# EAGLE design TheRug-Andabil-R2-prerel (EAGLE 7.7.0)

## Sheet 1 of 2
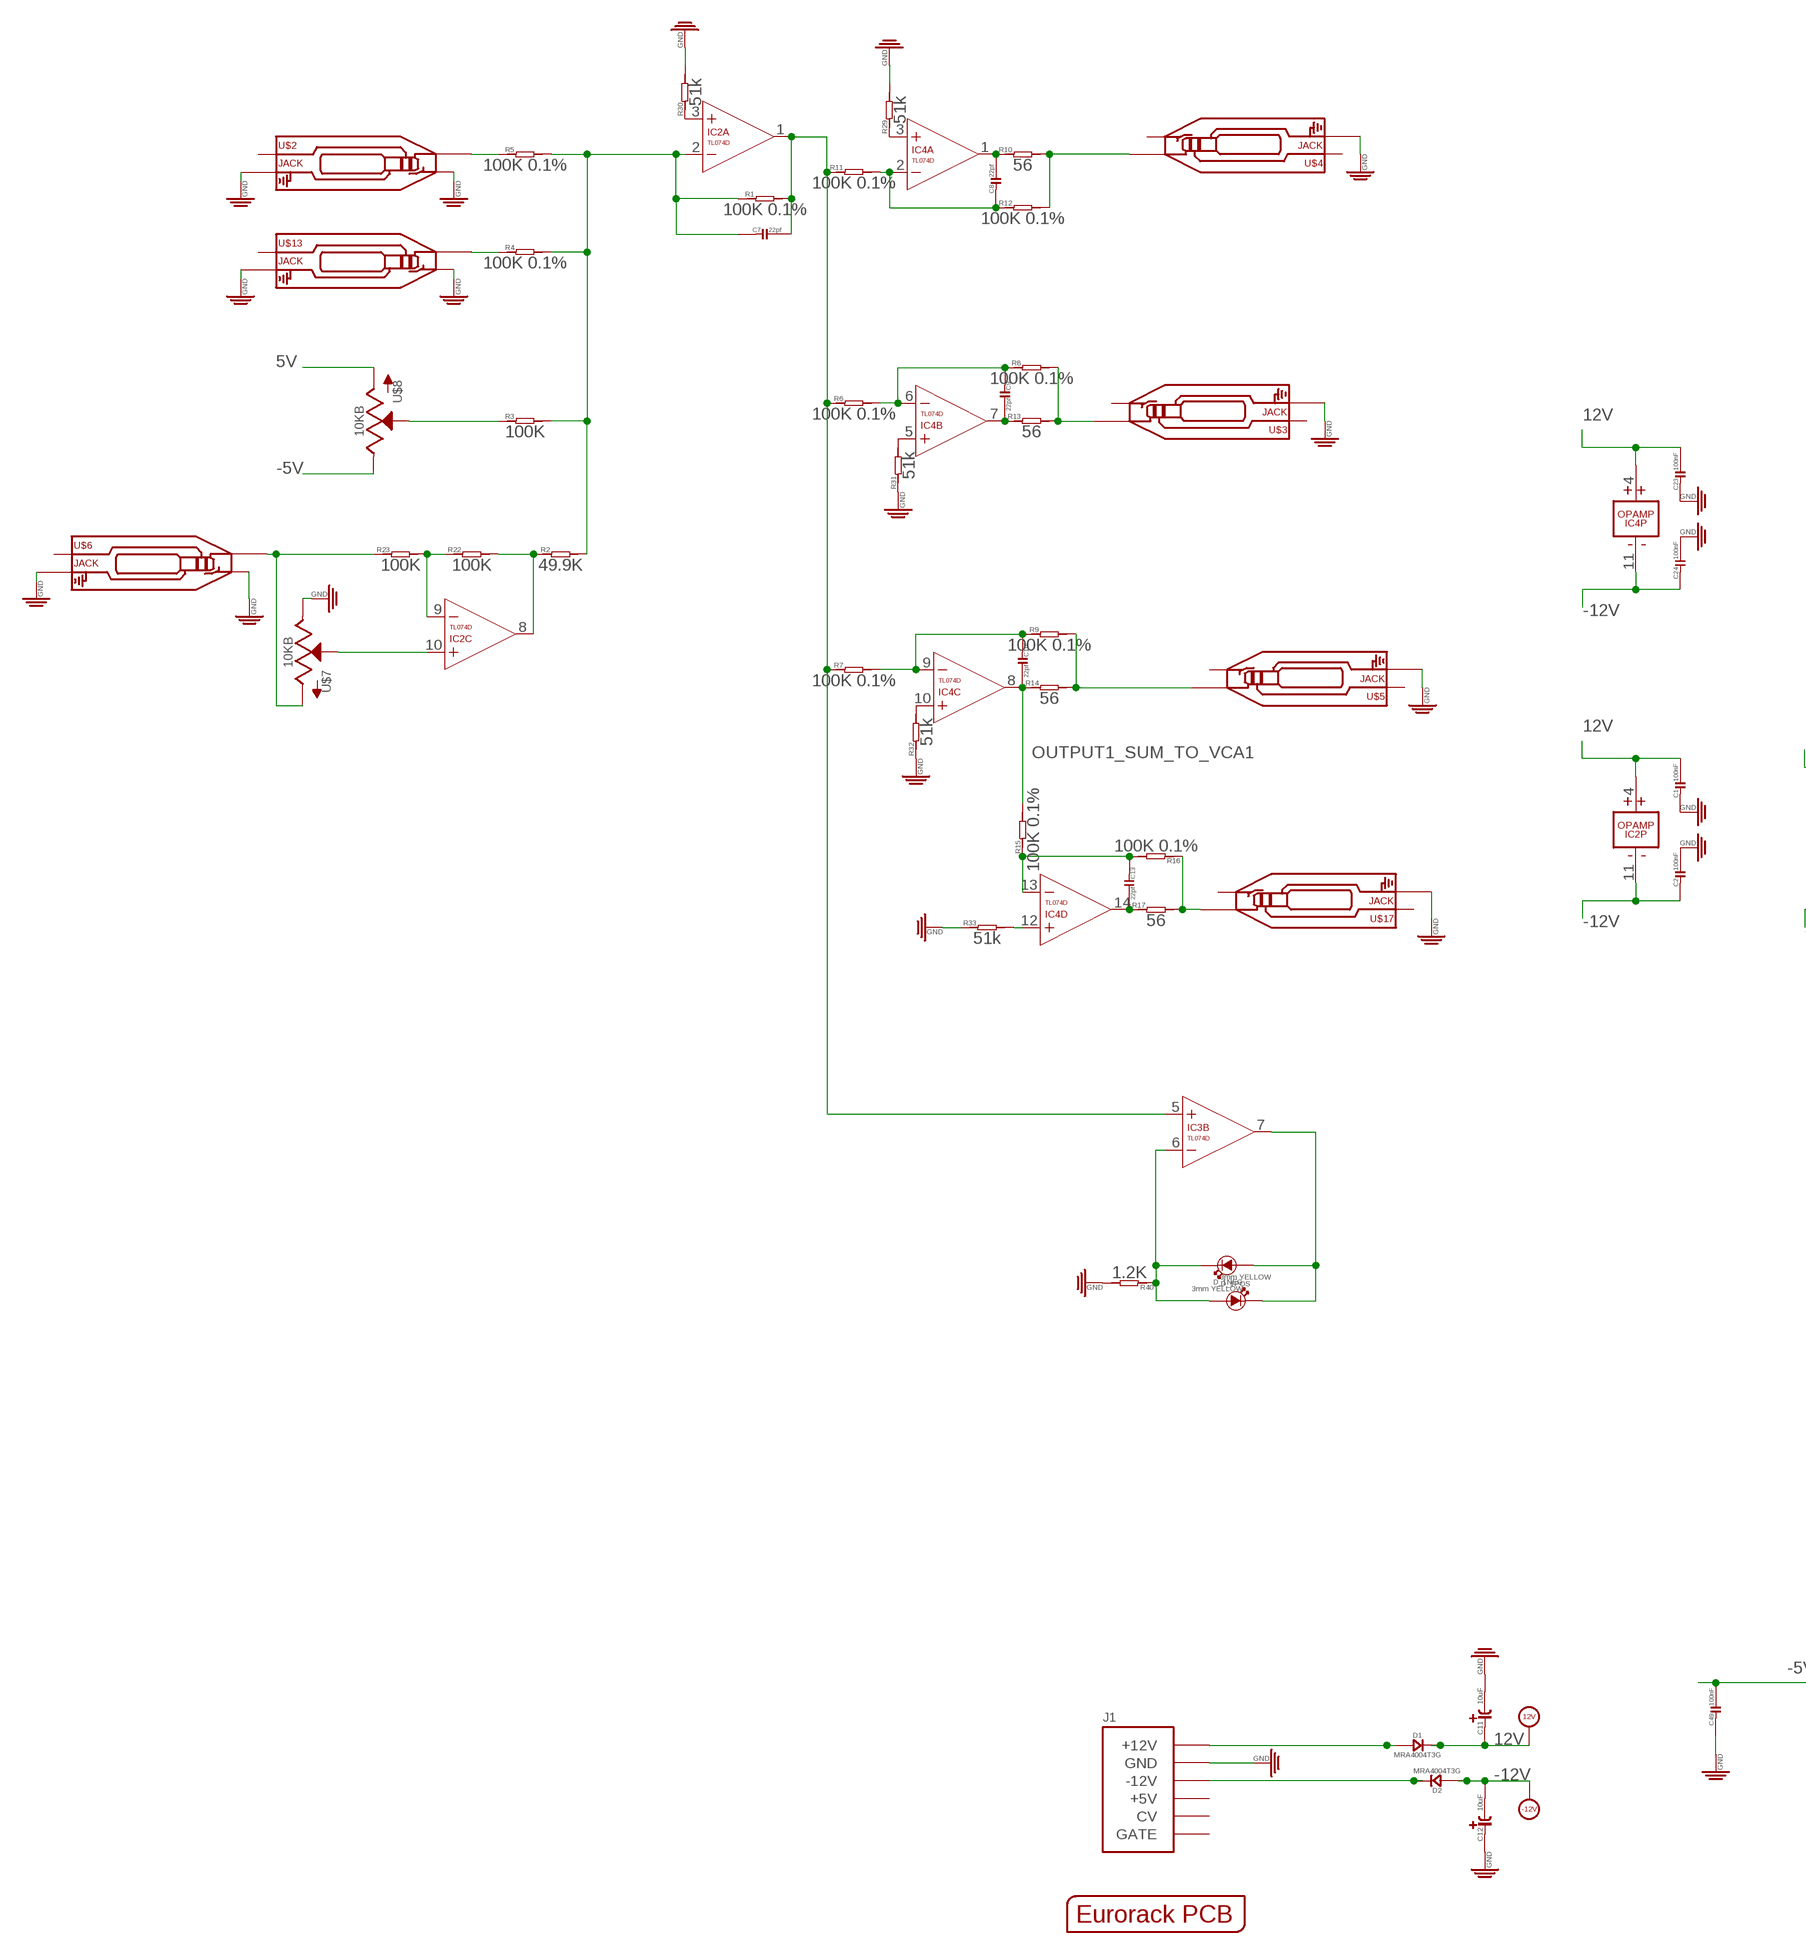
[diagram p0: schematic, sheet 1, part 1 of 2]
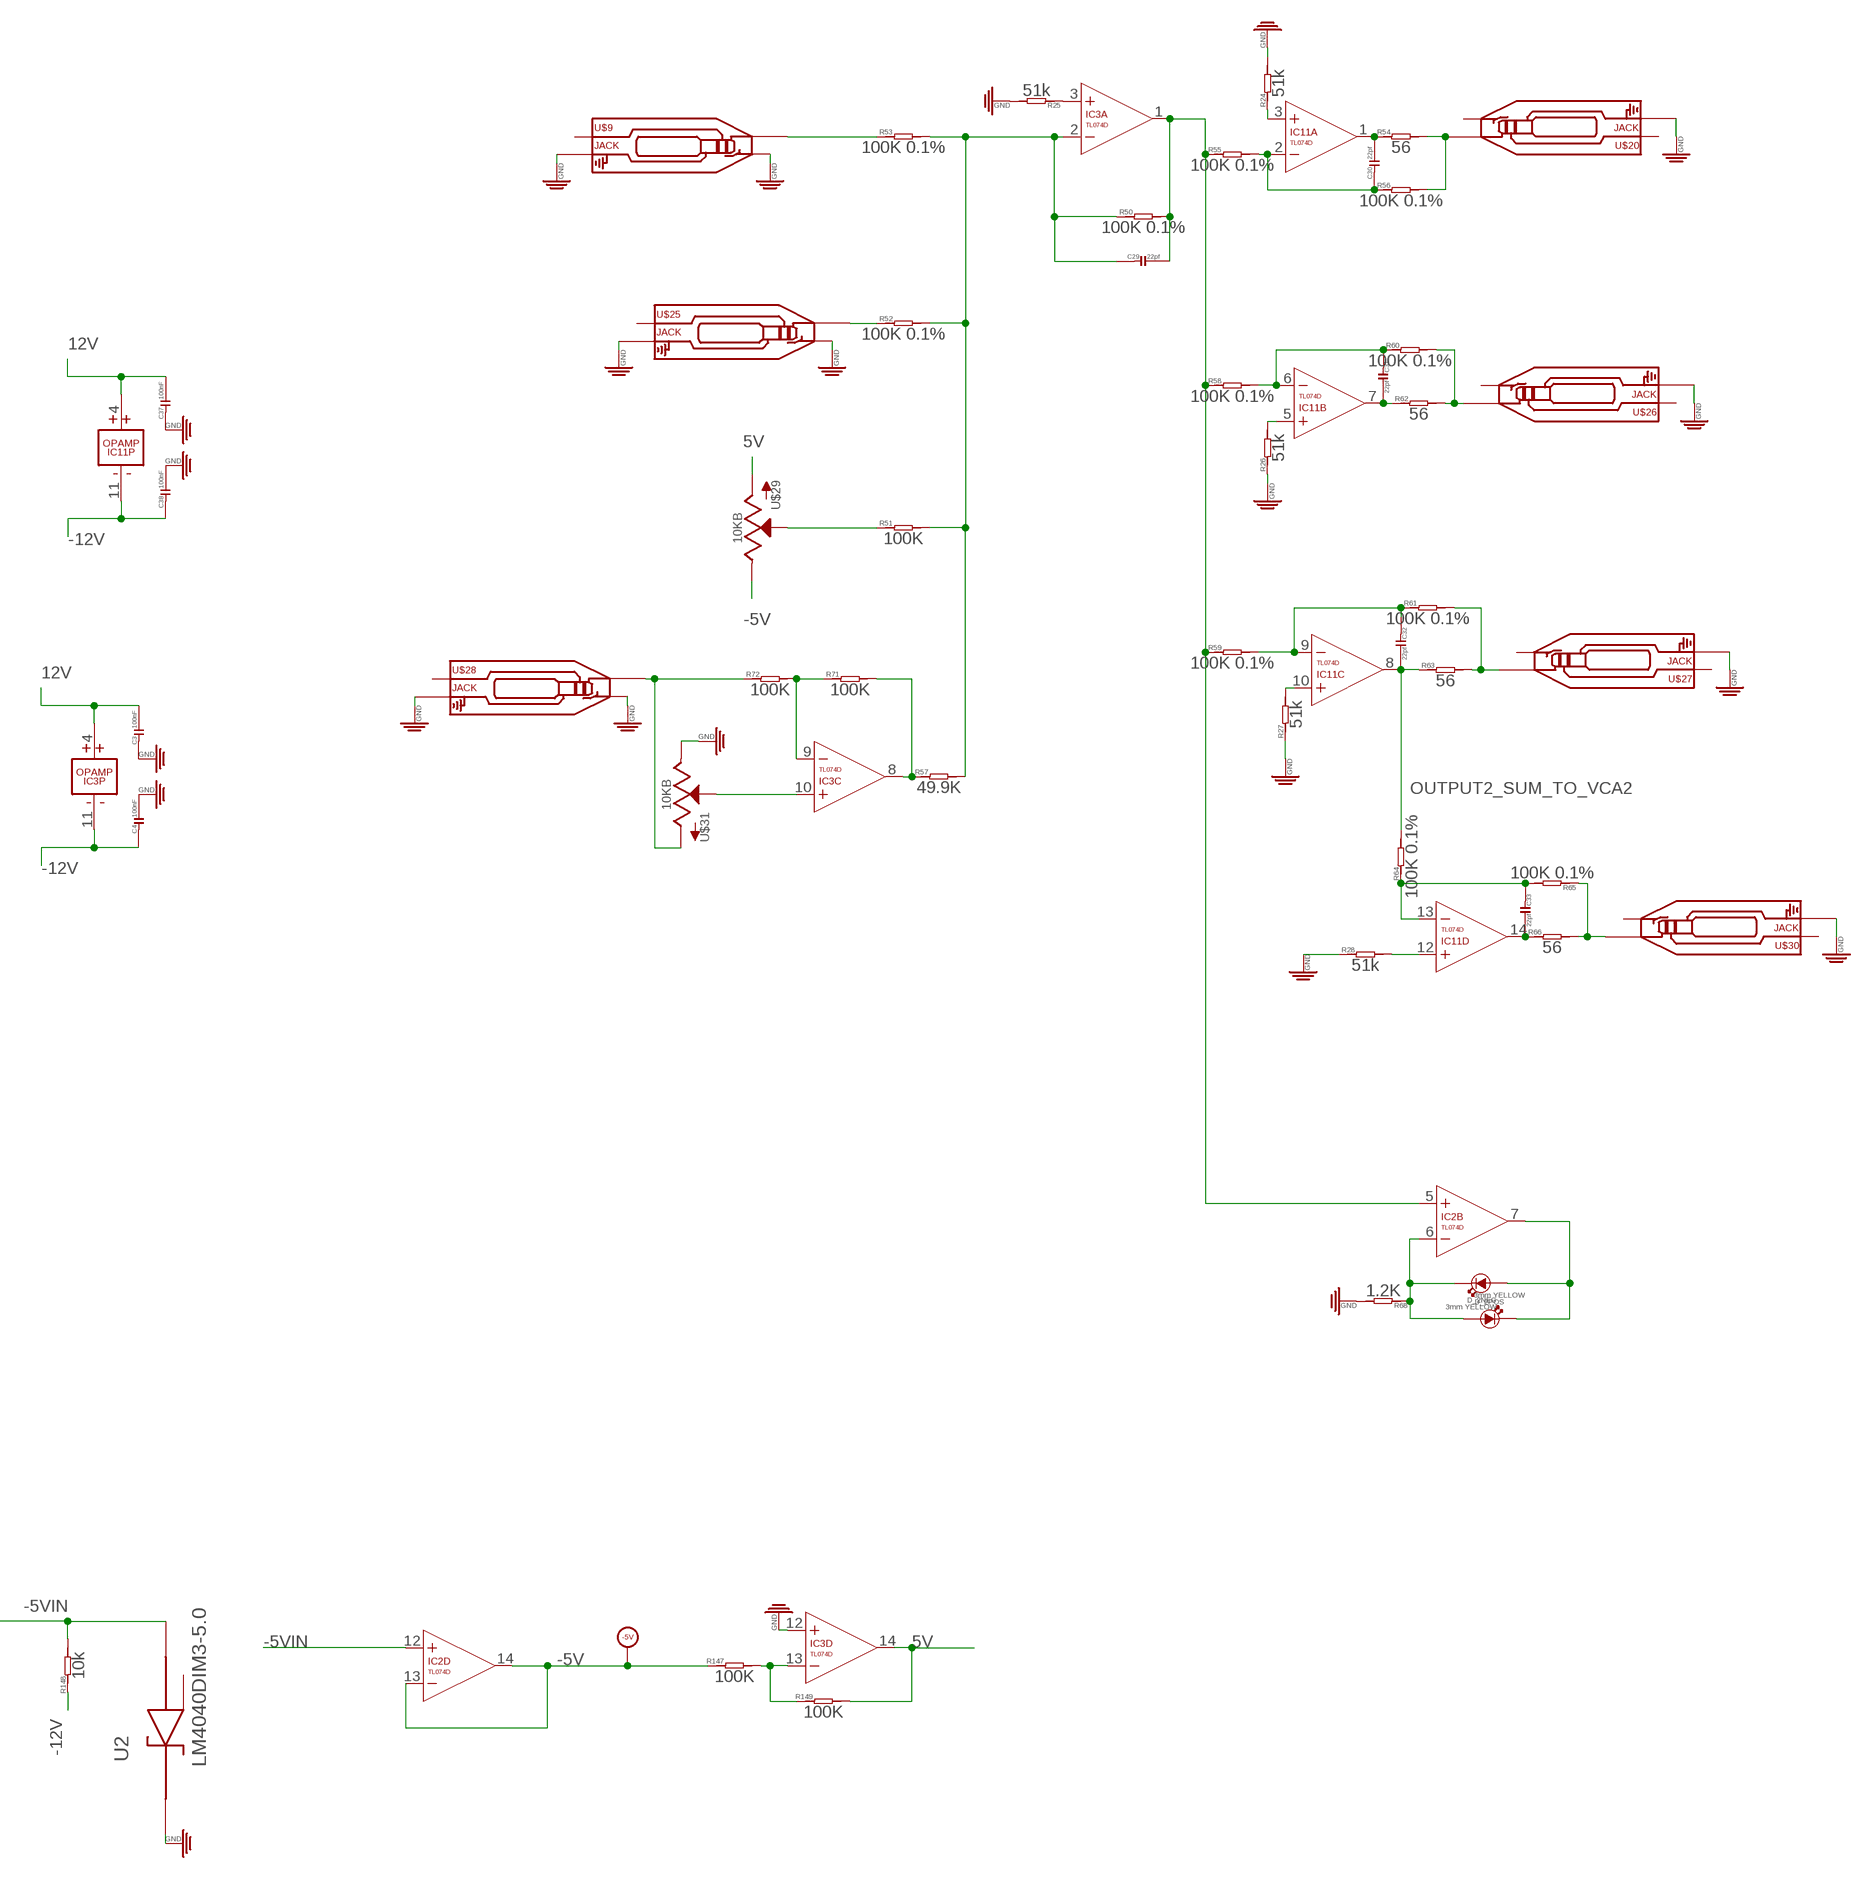
[diagram p1: schematic, sheet 1, part 2 of 2]

### Parts
C1  100nF  C-0603  [C0603]
C2  100nF  C-0603  [C0603]
C3  100nF  C-0603  [C0603]
C4  100nF  C-0603  [C0603]
C7  22pf  C-0603  [C0603]
C8  22pf  C-0603  [C0603]
C9  22pf  C-0603  [C0603]
C10  22pf  C-0603  [C0603]
C11  10uF  C-POLAR-A  [CASE-A_3216]
C12  10uF  C-POLAR-A  [CASE-A_3216]
C13  22pf  C-0603  [C0603]
C23  100nF  C-0603  [C0603]
C24  100nF  C-0603  [C0603]
C29  22pf  C-0603  [C0603]
C30  22pf  C-0603  [C0603]
C31  22pf  C-0603  [C0603]
C32  22pf  C-0603  [C0603]
C33  22pf  C-0603  [C0603]
C37  100nF  C-0603  [C0603]
C38  100nF  C-0603  [C0603]
C49  100nF  C-0603  [C0603]
D1  MRA4004T3G  D-SMA  [DO-214AC]
D2  MRA4004T3G  D-SMA  [DO-214AC]
D_1NEG  3mm YELLOW  LED3MM  [3MMLED]
D_1POS  3mm YELLOW  LED3MM  [3MMLED]
D_2NEG  3mm YELLOW  LED3MM  [3MMLED]
D_2POS  3mm YELLOW  LED3MM  [3MMLED]
IC2  TL074D  [SO14]
IC3  TL074D  [SO14]
IC4  TL074D  [SO14]
IC11  TL074D  [SO14]
J1  POWERSHROUDED  [POWER_16_SHROUDED]
R1  100K 0.1%  R-0603  [R0603]
R2  49.9K  R-0603  [R0603]
R3  100K  R-0603  [R0603]
R4  100K 0.1%  R-0603  [R0603]
R5  100K 0.1%  R-0603  [R0603]
R6  100K 0.1%  R-0603  [R0603]
R7  100K 0.1%  R-0603  [R0603]
R8  100K 0.1%  R-0603  [R0603]
R9  100K 0.1%  R-0603  [R0603]
R10  56  R-0603  [R0603]
R11  100K 0.1%  R-0603  [R0603]
R12  100K 0.1%  R-0603  [R0603]
R13  56  R-0603  [R0603]
R14  56  R-0603  [R0603]
R15  100K 0.1%  R-0603  [R0603]
R16  100K 0.1%  R-0603  [R0603]
R17  56  R-0603  [R0603]
R22  100K  R-0603  [R0603]
R23  100K  R-0603  [R0603]
R24  51k  R-0603  [R0603]
R25  51k  R-0603  [R0603]
R26  51k  R-0603  [R0603]
R27  51k  R-0603  [R0603]
R28  51k  R-0603  [R0603]
R29  51k  R-0603  [R0603]
R30  51k  R-0603  [R0603]
R31  51k  R-0603  [R0603]
R32  51k  R-0603  [R0603]
R33  51k  R-0603  [R0603]
R40  1.2K  R-0603  [R0603]
R50  100K 0.1%  R-0603  [R0603]
R51  100K  R-0603  [R0603]
R52  100K 0.1%  R-0603  [R0603]
R53  100K 0.1%  R-0603  [R0603]
R54  56  R-0603  [R0603]
R55  100K 0.1%  R-0603  [R0603]
R56  100K 0.1%  R-0603  [R0603]
R57  49.9K  R-0603  [R0603]
R58  100K 0.1%  R-0603  [R0603]
R59  100K 0.1%  R-0603  [R0603]
R60  100K 0.1%  R-0603  [R0603]
R61  100K 0.1%  R-0603  [R0603]
R62  56  R-0603  [R0603]
R63  56  R-0603  [R0603]
R64  100K 0.1%  R-0603  [R0603]
R65  100K 0.1%  R-0603  [R0603]
R66  56  R-0603  [R0603]
R68  1.2K  R-0603  [R0603]
R71  100K  R-0603  [R0603]
R72  100K  R-0603  [R0603]
R147  100K  R-0603  [R0603]
R148  10k  R-0603  [R0603]
R149  100K  R-0603  [R0603]
U2  LM4040DIM3-5.0  [SOT95P237X112-3N]
U$1  EURORACK_PCB12HP  [EURORACK12HPPCB]
U$2  JACK  AUDIO-JACK_SMALLSYMBOLNODRILL  [3.5MM-JACK-SWITCH-13MM-NOHOLES]
U$3  JACK  AUDIO-JACK_SMALLSYMBOLNODRILL  [3.5MM-JACK-SWITCH-13MM-NOHOLES]
U$4  JACK  AUDIO-JACK_SMALLSYMBOLNODRILL  [3.5MM-JACK-SWITCH-13MM-NOHOLES]
U$5  JACK  AUDIO-JACK_SMALLSYMBOLNODRILL  [3.5MM-JACK-SWITCH-13MM-NOHOLES]
U$6  JACK  AUDIO-JACK_SMALLSYMBOLNODRILL  [3.5MM-JACK-SWITCH-13MM-NOHOLES]
U$7  10KB  POTSQUAREHOLE_SMALLKNOB  [ALPS_POT_SQUAREHOLES]
U$8  10KB  POTSQUAREHOLE_SMALLKNOB  [ALPS_POT_SQUAREHOLES]
U$9  JACK  AUDIO-JACK_SMALLSYMBOLNODRILL  [3.5MM-JACK-SWITCH-13MM-NOHOLES]
U$13  JACK  AUDIO-JACK_SMALLSYMBOLNODRILL  [3.5MM-JACK-SWITCH-13MM-NOHOLES]
U$17  JACK  AUDIO-JACK_SMALLSYMBOLNODRILL  [3.5MM-JACK-SWITCH-13MM-NOHOLES]
U$20  JACK  AUDIO-JACK_SMALLSYMBOLNODRILL  [3.5MM-JACK-SWITCH-13MM-NOHOLES]
U$25  JACK  AUDIO-JACK_SMALLSYMBOLNODRILL  [3.5MM-JACK-SWITCH-13MM-NOHOLES]
U$26  JACK  AUDIO-JACK_SMALLSYMBOLNODRILL  [3.5MM-JACK-SWITCH-13MM-NOHOLES]
U$27  JACK  AUDIO-JACK_SMALLSYMBOLNODRILL  [3.5MM-JACK-SWITCH-13MM-NOHOLES]
U$28  JACK  AUDIO-JACK_SMALLSYMBOLNODRILL  [3.5MM-JACK-SWITCH-13MM-NOHOLES]
U$29  10KB  POTSQUAREHOLE_SMALLKNOB  [ALPS_POT_SQUAREHOLES]
U$30  JACK  AUDIO-JACK_SMALLSYMBOLNODRILL  [3.5MM-JACK-SWITCH-13MM-NOHOLES]
U$31  10KB  POTSQUAREHOLE_SMALLKNOB  [ALPS_POT_SQUAREHOLES]

### Nets
5V [heavypower]: IC3.14(D:OUT) R149.2 U$8.P$3(A) U$29.P$3(A)
12V [heavypower]: C1.2 C3.2 C11.+ C23.2 C37.2 D1.2(-) IC2.4(P:V+) IC3.4(P:V+) IC4.4(P:V+) IC11.4(P:V+) ; also sheet 2
-5V [heavypower]: IC2.13(D:-IN) IC2.14(D:OUT) R147.1 U$8.P$1(E) U$29.P$1(E) ; also sheet 2
-5V_TO_5V: IC3.13(D:-IN) R147.2 R149.1
-5VIN [heavypower]: C49.2 IC2.12(D:+IN) R148.2 U2.2(ANODE)
-12V [heavypower]: C2.1 C4.1 C12.- C24.1 C38.1 D2.1(+) IC2.11(P:V-) IC3.11(P:V-) IC4.11(P:V-) IC11.11(P:V-) R148.1 ; also sheet 2
GND: C1.1 C2.2 C3.1 C4.2 C11.- C12.+ C23.1 C24.2 C37.1 C38.2 C49.1 IC3.12(D:+IN) J1.3(GND) J1.4(GND) J1.5(GND) J1.6(GND) J1.7(GND) J1.8(GND) R24.2 R25.2 R26.1 R27.1 R28.1 R29.2 R30.2 R31.1 R32.1 R33.1 R40.2 R68.2 U2.1(CATHODE) U$2.RING_B@1(RING) U$2.RING_T@3(RING) U$2.SWITCH_B@1(SWITCH) U$2.SWITCH_T@3(SWITCH) U$3.RING_B@1(RING) U$3.RING_T@3(RING) U$4.RING_B@1(RING) U$4.RING_T@3(RING) U$5.RING_B@1(RING) U$5.RING_T@3(RING) U$6.RING_B@1(RING) U$6.RING_T@3(RING) U$6.SWITCH_B@1(SWITCH) U$6.SWITCH_T@3(SWITCH) U$7.P$1(E) U$9.RING_B@1(RING) U$9.RING_T@3(RING) U$9.SWITCH_B@1(SWITCH) U$9.SWITCH_T@3(SWITCH) U$13.RING_B@1(RING) U$13.RING_T@3(RING) U$13.SWITCH_B@1(SWITCH) U$13.SWITCH_T@3(SWITCH) U$17.RING_B@1(RING) U$17.RING_T@3(RING) U$20.RING_B@1(RING) U$20.RING_T@3(RING) U$25.RING_B@1(RING) U$25.RING_T@3(RING) U$25.SWITCH_B@1(SWITCH) U$25.SWITCH_T@3(SWITCH) U$26.RING_B@1(RING) U$26.RING_T@3(RING) U$27.RING_B@1(RING) U$27.RING_T@3(RING) U$28.RING_B@1(RING) U$28.RING_T@3(RING) U$28.SWITCH_B@1(SWITCH) U$28.SWITCH_T@3(SWITCH) U$30.RING_B@1(RING) U$30.RING_T@3(RING) U$31.P$1(E) ; also sheet 2
N$1: IC2.10(C:+IN) U$7.P$2(S)
N$2: C8.2 IC4.1(A:OUT) R10.1
N$3: IC2.8(C:OUT) R2.1 R22.2
N$4: R23.1 U$6.TIP_B@1(TIP) U$6.TIP_T@3(TIP) U$7.P$3(A)
N$5: C9.1 IC4.6(B:-IN) R6.2 R8.1
N$6: R3.1 U$8.P$2(S)
N$7: C7.2 IC2.1(A:OUT) IC3.5(B:+IN) R1.2 R6.1 R7.1 R11.1
N$8: C8.1 IC4.2(A:-IN) R11.2 R12.1
N$9: C10.1 IC4.9(C:-IN) R7.2 R9.1
N$10: IC2.9(C:-IN) R22.1 R23.2
N$11: C9.2 IC4.7(B:OUT) R13.1
N$12: R4.1 U$13.TIP_B@1(TIP) U$13.TIP_T@3(TIP)
N$13: R60.2 R62.2 U$26.TIP_B@1(TIP) U$26.TIP_T@3(TIP)
N$14: C7.1 IC2.2(A:-IN) R1.1 R2.2 R3.2 R4.2 R5.2
N$15: R8.2 R13.2 U$3.TIP_B@1(TIP) U$3.TIP_T@3(TIP)
N$16: R9.2 R14.2 U$5.TIP_B@1(TIP) U$5.TIP_T@3(TIP)
N$17: C13.1 IC4.13(D:-IN) R15.1 R16.2
N$18: C13.2 IC4.14(D:OUT) R17.1
N$19: R16.1 R17.2 U$17.TIP_B@1(TIP) U$17.TIP_T@3(TIP)
N$20: R5.1 U$2.TIP_B@1(TIP) U$2.TIP_T@3(TIP)
N$22: R10.2 R12.2 U$4.TIP_B@1(TIP) U$4.TIP_T@3(TIP)
N$26: IC11.3(A:+IN) R24.1
N$27: IC3.3(A:+IN) R25.1
N$28 [heavypower]: D1.1(+) J1.9(+12V) J1.10(+12V)
N$29: IC11.5(B:+IN) R26.2
N$30: IC11.10(C:+IN) R27.2
N$31: R65.1 R66.2 U$30.TIP_B@1(TIP) U$30.TIP_T@3(TIP)
N$32: IC11.12(D:+IN) R28.2
N$33: IC4.3(A:+IN) R29.1
N$34: IC2.3(A:+IN) R30.1
N$35: IC4.5(B:+IN) R31.2
N$36: IC4.10(C:+IN) R32.2
N$37: IC4.12(D:+IN) R33.2
N$44: D_1NEG.- D_1POS.+ IC3.6(B:-IN) R40.1
N$45: D_1NEG.+ D_1POS.- IC3.7(B:OUT)
N$53: C30.2 IC11.1(A:OUT) R54.1
N$54: R51.1 U$29.P$2(S)
N$63: R52.1 U$25.TIP_B@1(TIP) U$25.TIP_T@3(TIP)
N$64 [heavypower]: D2.2(-) J1.1(-12V) J1.2(-12V)
N$65: C29.1 IC3.2(A:-IN) R50.1 R51.2 R52.2 R53.2 R57.2
N$66: R54.2 R56.2 U$20.TIP_B@1(TIP) U$20.TIP_T@3(TIP)
N$67: C29.2 IC2.5(B:+IN) IC3.1(A:OUT) R50.2 R55.1 R58.1 R59.1
N$68: C30.1 IC11.2(A:-IN) R55.2 R56.1
N$69: R53.1 U$9.TIP_B@1(TIP) U$9.TIP_T@3(TIP)
N$70: R72.1 U$28.TIP_B@1(TIP) U$28.TIP_T@3(TIP) U$31.P$3(A)
N$71: C31.1 IC11.6(B:-IN) R58.2 R60.1
N$72: C32.1 IC11.9(C:-IN) R59.2 R61.1
N$73: C31.2 IC11.7(B:OUT) R62.1
N$76: R61.2 R63.2 U$27.TIP_B@1(TIP) U$27.TIP_T@3(TIP)
N$77: C33.1 IC11.13(D:-IN) R64.1 R65.2
N$78: C33.2 IC11.14(D:OUT) R66.1
N$80: D_2NEG.- D_2POS.+ IC2.6(B:-IN) R68.1
N$81: D_2NEG.+ D_2POS.- IC2.7(B:OUT)
N$84: IC3.10(C:+IN) U$31.P$2(S)
N$85: IC3.8(C:OUT) R57.1 R71.2
N$86: IC3.9(C:-IN) R71.1 R72.2
OUTPUT1_SUM_TO_VCA1: C10.2 IC4.8(C:OUT) R14.1 R15.2 ; also sheet 2
OUTPUT2_SUM_TO_VCA2: C32.2 IC11.8(C:OUT) R63.1 R64.2 ; also sheet 2
Unconnected: J1.11(+5V) J1.12(+5V) J1.13(CV) J1.14(CV) J1.15(GATE) J1.16(GATE) U2.3(NC) U$2.SECOND_B@1(SECOND) U$2.SECOND_T@3(SECOND) U$3.SECOND_B@1(SECOND) U$3.SECOND_T@3(SECOND) U$3.SWITCH_B@1(SWITCH) U$3.SWITCH_T@3(SWITCH) U$4.SECOND_B@1(SECOND) U$4.SECOND_T@3(SECOND) U$4.SWITCH_B@1(SWITCH) U$4.SWITCH_T@3(SWITCH) U$5.SECOND_B@1(SECOND) U$5.SECOND_T@3(SECOND) U$5.SWITCH_B@1(SWITCH) U$5.SWITCH_T@3(SWITCH) U$6.SECOND_B@1(SECOND) U$6.SECOND_T@3(SECOND) U$9.SECOND_B@1(SECOND) U$9.SECOND_T@3(SECOND) U$13.SECOND_B@1(SECOND) U$13.SECOND_T@3(SECOND) U$17.SECOND_B@1(SECOND) U$17.SECOND_T@3(SECOND) U$17.SWITCH_B@1(SWITCH) U$17.SWITCH_T@3(SWITCH) U$20.SECOND_B@1(SECOND) U$20.SECOND_T@3(SECOND) U$20.SWITCH_B@1(SWITCH) U$20.SWITCH_T@3(SWITCH) U$25.SECOND_B@1(SECOND) U$25.SECOND_T@3(SECOND) U$26.SECOND_B@1(SECOND) U$26.SECOND_T@3(SECOND) U$26.SWITCH_B@1(SWITCH) U$26.SWITCH_T@3(SWITCH) U$27.SECOND_B@1(SECOND) U$27.SECOND_T@3(SECOND) U$27.SWITCH_B@1(SWITCH) U$27.SWITCH_T@3(SWITCH) U$28.SECOND_B@1(SECOND) U$28.SECOND_T@3(SECOND) U$30.SECOND_B@1(SECOND) U$30.SECOND_T@3(SECOND) U$30.SWITCH_B@1(SWITCH) U$30.SWITCH_T@3(SWITCH)

## Sheet 2 of 2
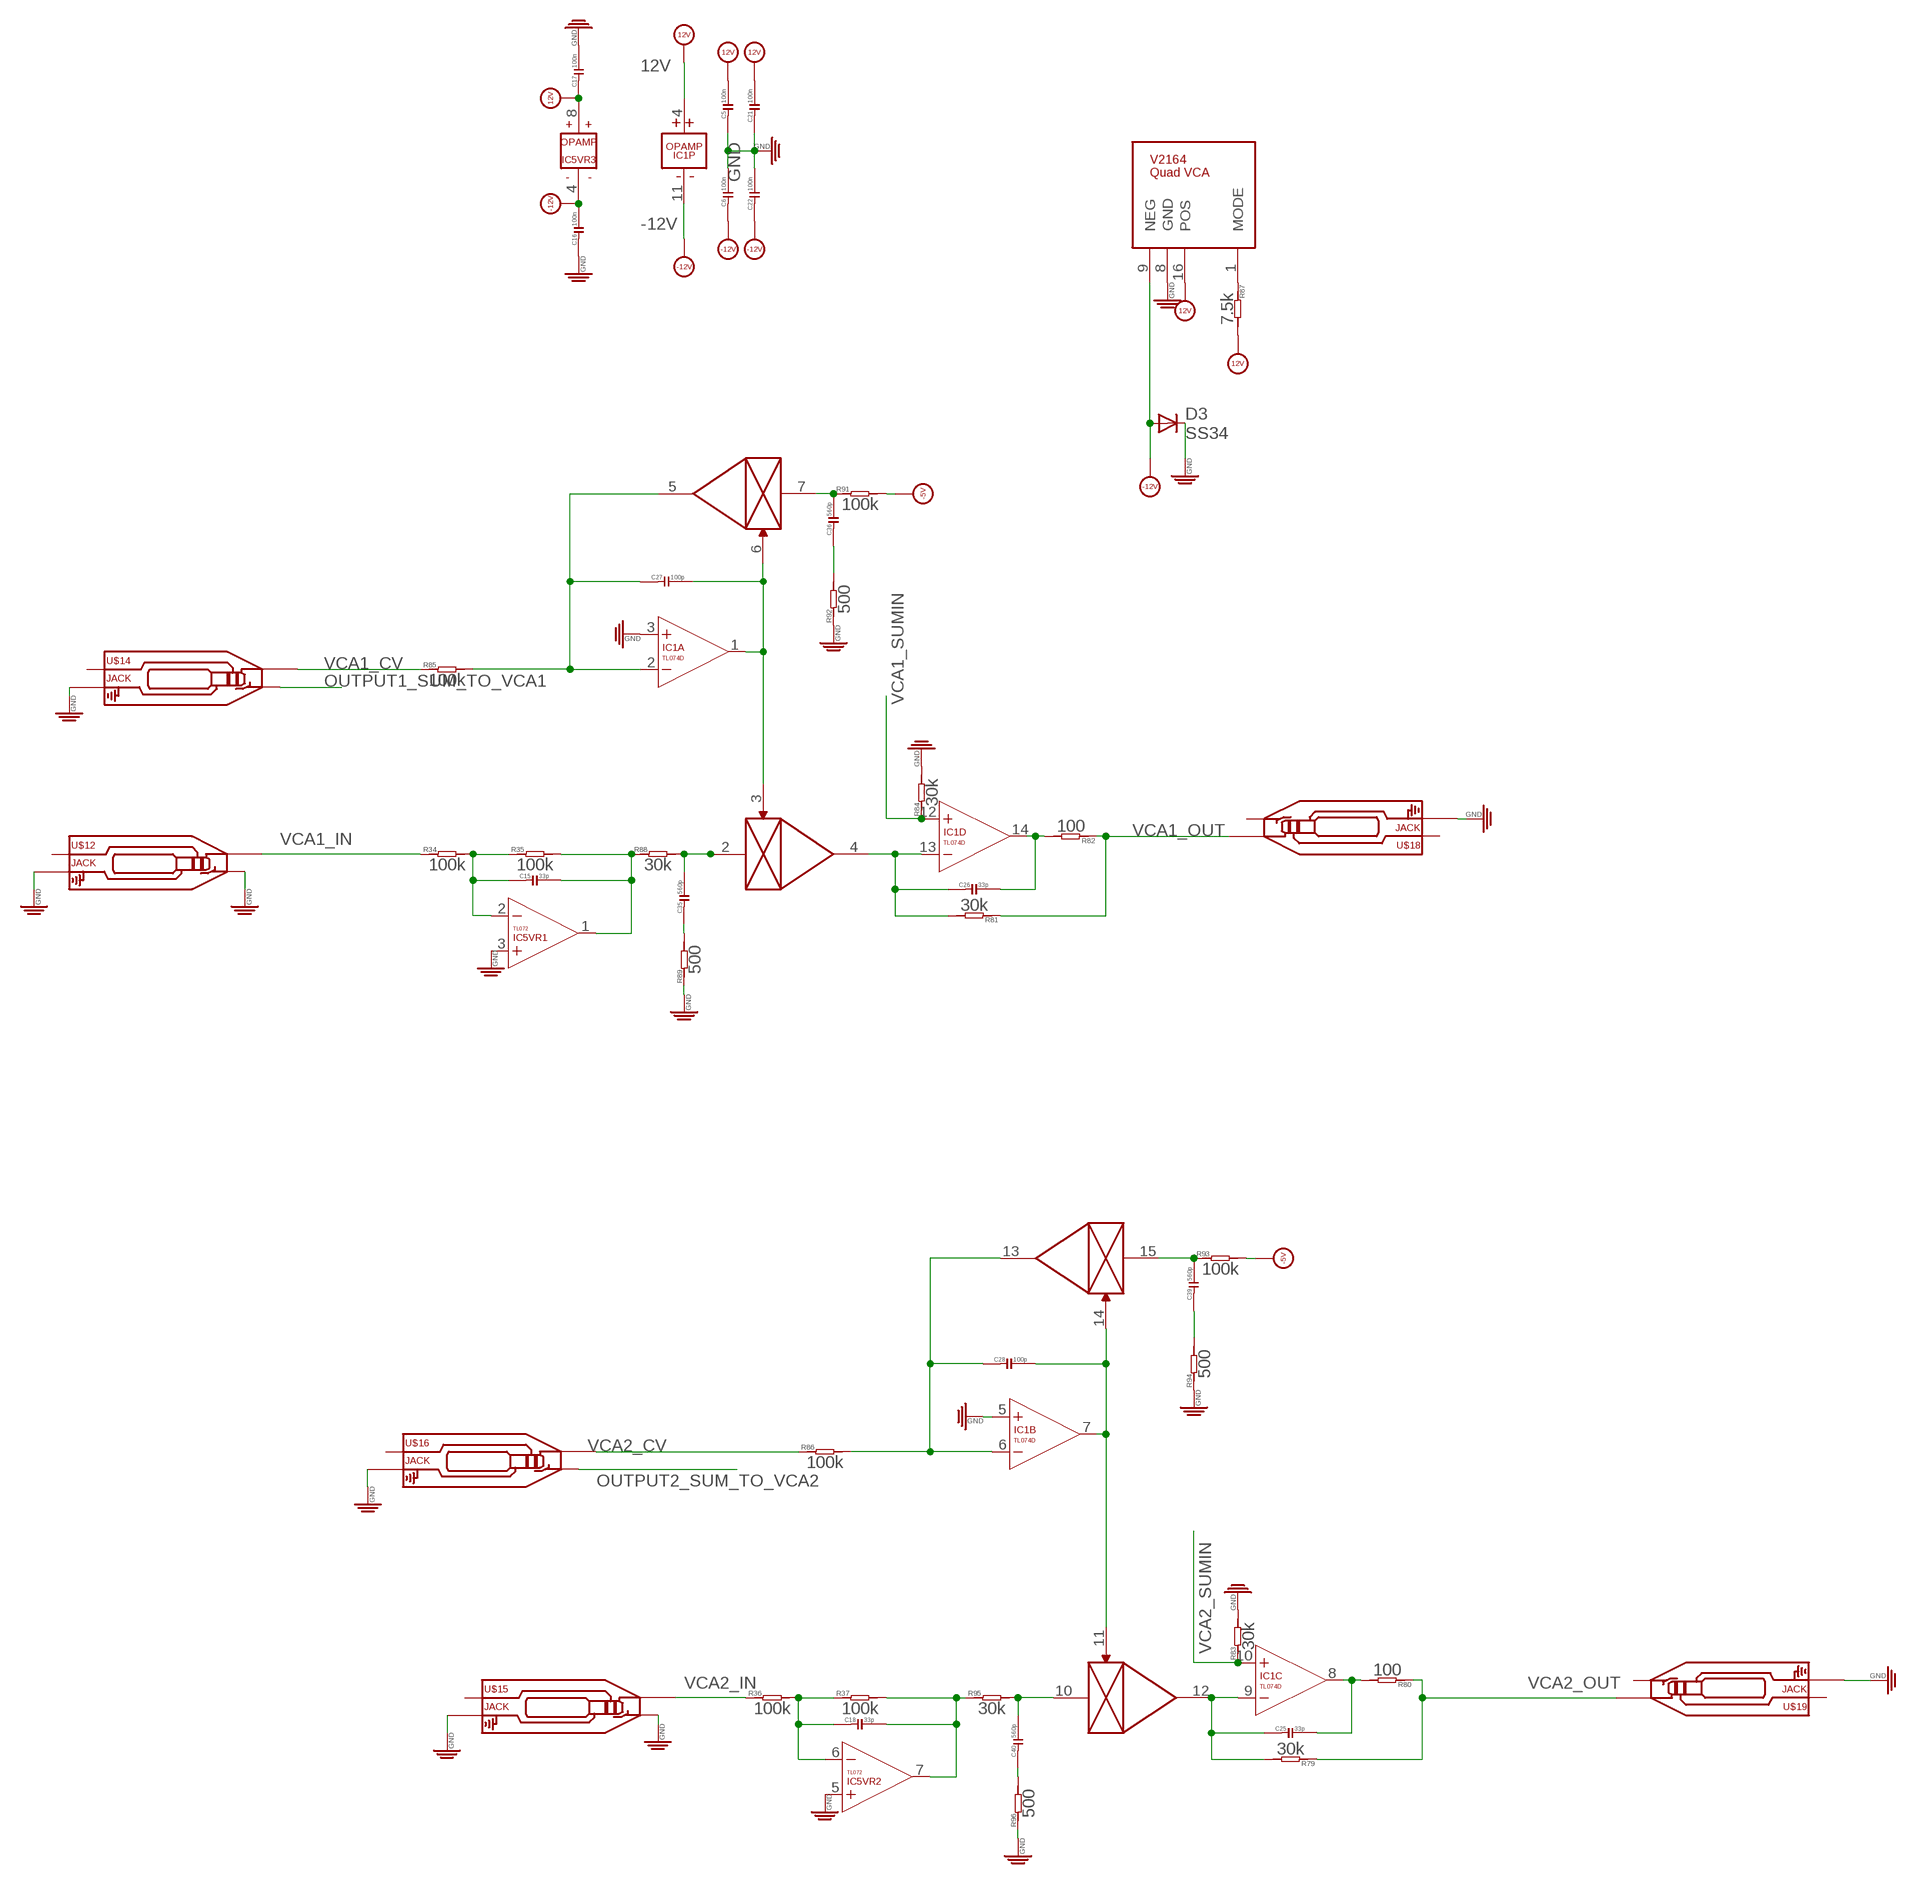
[diagram p2: schematic, sheet 2]

### Parts
C5  100n  C-0603  [C0603]
C6  100n  C-0603  [C0603]
C15  33p  C-0603  [C0603]
C16  100n  C-0603  [C0603]
C17  100n  C-0603  [C0603]
C18  33p  C-0603  [C0603]
C21  100n  C-0603  [C0603]
C22  100n  C-0603  [C0603]
C25  33p  C-0603  [C0603]
C26  33p  C-0603  [C0603]
C27  100p  C-0603  [C0603]
C28  100p  C-0603  [C0603]
C35  560p  C-0603  [C0603]
C36  560p  C-0603  [C0603]
C39  560p  C-0603  [C0603]
C40  560p  C-0603  [C0603]
D3  SS34  DIODE-DO-214AC  [DO-214AC]
IC1  TL074D  [SO14]
IC5  TL072  [SO08]
R34  100k  R-0603  [R0603]
R35  100k  R-0603  [R0603]
R36  100k  R-0603  [R0603]
R37  100k  R-0603  [R0603]
R79  30k  R-0603  [R0603]
R80  100  R-0603  [R0603]
R81  30k  R-0603  [R0603]
R82  100  R-0603  [R0603]
R83  30k  R-0603  [R0603]
R84  30k  R-0603  [R0603]
R85  100k  R-0603  [R0603]
R86  100k  R-0603  [R0603]
R87  7.5k  R-0603  [R0603]
R88  30k  R-0603  [R0603]
R89  500  R-0603  [R0603]
R91  100k  R-0603  [R0603]
R92  500  R-0603  [R0603]
R93  100k  R-0603  [R0603]
R94  500  R-0603  [R0603]
R95  30k  R-0603  [R0603]
R96  500  R-0603  [R0603]
U$12  JACK  AUDIO-JACK_SMALLSYMBOLNODRILL  [3.5MM-JACK-SWITCH-13MM-NOHOLES]
U$14  JACK  AUDIO-JACK_SMALLSYMBOLNODRILL  [3.5MM-JACK-SWITCH-13MM-NOHOLES]
U$15  JACK  AUDIO-JACK_SMALLSYMBOLNODRILL  [3.5MM-JACK-SWITCH-13MM-NOHOLES]
U$16  JACK  AUDIO-JACK_SMALLSYMBOLNODRILL  [3.5MM-JACK-SWITCH-13MM-NOHOLES]
U$18  JACK  AUDIO-JACK_SMALLSYMBOLNODRILL  [3.5MM-JACK-SWITCH-13MM-NOHOLES]
U$19  JACK  AUDIO-JACK_SMALLSYMBOLNODRILL  [3.5MM-JACK-SWITCH-13MM-NOHOLES]
U$32  V2164  [SO16]

### Nets
12V [heavypower]: C5.2 C17.1 C21.2 IC1.4(P:V+) IC5.8(VR3:V+) R87.2 U$32.16(PWR:POS) ; also sheet 1
-5V [heavypower]: R91.2 R93.2 ; also sheet 1
-12V [heavypower]: C6.1 C16.2 C22.1 D3.2(A) IC1.11(P:V-) IC5.4(VR3:V-) U$32.9(PWR:NEG) ; also sheet 1
GND: C5.1 C6.2 C16.1 C17.2 C21.1 C22.2 D3.1(C) IC1.3(A:+IN) IC1.5(B:+IN) IC5.3(VR1:+IN) IC5.5(VR2:+IN) R83.2 R84.2 R89.1 R92.1 R94.1 R96.1 U$12.RING_B@1(RING) U$12.RING_T@3(RING) U$12.SWITCH_B@1(SWITCH) U$12.SWITCH_T@3(SWITCH) U$14.RING_B@1(RING) U$14.RING_T@3(RING) U$15.RING_B@1(RING) U$15.RING_T@3(RING) U$15.SWITCH_B@1(SWITCH) U$15.SWITCH_T@3(SWITCH) U$16.RING_B@1(RING) U$16.RING_T@3(RING) U$18.RING_B@1(RING) U$18.RING_T@3(RING) U$19.RING_B@1(RING) U$19.RING_T@3(RING) U$32.8(PWR:GND) ; also sheet 1
N$38: C15.1 IC5.2(VR1:-IN) R34.2 R35.1
N$39: C15.2 IC5.1(VR1:OUT) R35.2 R88.1
N$40: C18.1 IC5.6(VR2:-IN) R36.2 R37.1
N$41: C18.2 IC5.7(VR2:OUT) R37.2 R95.1
N$61: C25.2 IC1.8(C:OUT) R80.2
N$74: C25.1 IC1.9(C:-IN) R79.2 U$32.12(C:OUT)
N$87: C26.2 IC1.14(D:OUT) R82.2
N$88: C26.1 IC1.13(D:-IN) R81.2 U$32.4(A:OUT)
N$89: C27.2 IC1.1(A:OUT) U$32.3(A:CV) U$32.6(B:CV)
N$90: C28.1 IC1.6(B:-IN) R86.2 U$32.13(D:OUT)
N$91: C28.2 IC1.7(B:OUT) U$32.11(C:CV) U$32.14(D:CV)
N$92: R87.1 U$32.1(PWR:MODE)
N$93: C35.1 R89.2
N$94: C35.2 R88.2 U$32.2(A:IN)
N$95: C36.2 R91.1 U$32.7(B:IN)
N$96: C36.1 R92.2
N$97: C39.2 R93.1 U$32.15(D:IN)
N$98: C39.1 R94.2
N$99: C40.1 R96.2
N$100: C40.2 R95.2 U$32.10(C:IN)
OUTPUT1_SUM_TO_VCA1: U$14.SWITCH_B@1(SWITCH) U$14.SWITCH_T@3(SWITCH) ; also sheet 1
OUTPUT2_SUM_TO_VCA2: U$16.SWITCH_B@1(SWITCH) U$16.SWITCH_T@3(SWITCH) ; also sheet 1
VCA1_CV: R85.1 U$14.TIP_B@1(TIP) U$14.TIP_T@3(TIP)
VCA1_FB: C27.1 IC1.2(A:-IN) R85.2 U$32.5(B:OUT)
VCA1_IN: R34.1 U$12.TIP_B@1(TIP) U$12.TIP_T@3(TIP)
VCA1_OUT: R81.1 R82.1 U$18.TIP_B@1(TIP) U$18.TIP_T@3(TIP)
VCA1_SUMIN: IC1.12(D:+IN) R84.1
VCA2_CV: R86.1 U$16.TIP_B@1(TIP) U$16.TIP_T@3(TIP)
VCA2_IN: R36.1 U$15.TIP_B@1(TIP) U$15.TIP_T@3(TIP)
VCA2_OUT: R79.1 R80.1 U$19.TIP_B@1(TIP) U$19.TIP_T@3(TIP)
VCA2_SUMIN: IC1.10(C:+IN) R83.1
Unconnected: U$12.SECOND_B@1(SECOND) U$12.SECOND_T@3(SECOND) U$14.SECOND_B@1(SECOND) U$14.SECOND_T@3(SECOND) U$15.SECOND_B@1(SECOND) U$15.SECOND_T@3(SECOND) U$16.SECOND_B@1(SECOND) U$16.SECOND_T@3(SECOND) U$18.SECOND_B@1(SECOND) U$18.SECOND_T@3(SECOND) U$18.SWITCH_B@1(SWITCH) U$18.SWITCH_T@3(SWITCH) U$19.SECOND_B@1(SECOND) U$19.SECOND_T@3(SECOND) U$19.SWITCH_B@1(SWITCH) U$19.SWITCH_T@3(SWITCH)

## Library data of the parts
C1-C10 C13 C15-C18 C21-C33 C35-C40 = OPL:C*
C11 C12 = EurorackModularParts:C-POLAR*
C49 = OPL:C*; MF: AVX; MPN: 06035C104KAT2A; OC_FARNELL: 1301804
D1 D2 = OPL:D*: DIODE; MF: VISHAY; MPN: US1G-E3/5AT; OC_FARNELL: 9551824
D3 = dp_devices:DIODE: Various Diode Packages
D_1NEG D_1POS D_2NEG D_2POS = EurorackModularParts:LED*: LED
IC1-IC4 IC11 = EurorackModularParts:TL074: OP AMP
IC5 = EurorackModularParts:TL072
J1 = EurorackModularParts:POWER
R1-R17 R22-R37 R40 R50-R66 R68 R71 R72 R79-R89 R91-R96 R147 R149 = OPL:R*
R148 = OPL:R*; OC_FARNELL: unknown
U2 = FarnellThings:LM4040DIM3-5.0: IC, Precision Micropower Shunt Voltage Reference, 5V,SOT-23-3; MF: TEXAS INSTRUMENTS; MPN: LM4040DIM3-5.0; OC_FARNELL: 9778330; OC_NEWARK: 97K3489; PACKAGE: SOT-23-3; SUPPLIER: TEXAS INSTRUMENTS
U$1 = EurorackModularParts:EURORACK_PCB
U$2 = EurorackModularParts:AUDIO-JACK_SMALLSYMBOL: Switching Mono 3.5mm Audio Jack from Erthenvar.; DESC: 1: A
U$3 = EurorackModularParts:AUDIO-JACK_SMALLSYMBOL: Switching Mono 3.5mm Audio Jack from Erthenvar.; DESC: 1: Out 2
U$4 = EurorackModularParts:AUDIO-JACK_SMALLSYMBOL: Switching Mono 3.5mm Audio Jack from Erthenvar.; DESC: 1: Out 1
U$5 = EurorackModularParts:AUDIO-JACK_SMALLSYMBOL: Switching Mono 3.5mm Audio Jack from Erthenvar.; DESC: 1: Out 3
U$6 = EurorackModularParts:AUDIO-JACK_SMALLSYMBOL: Switching Mono 3.5mm Audio Jack from Erthenvar.; DESC: 1: C
U$7 = EurorackModularParts:POT; DESC: 1: C Amp
U$8 = EurorackModularParts:POT; DESC: 1: Offset
U$9 = EurorackModularParts:AUDIO-JACK_SMALLSYMBOL: Switching Mono 3.5mm Audio Jack from Erthenvar.; DESC: 2: A
U$12 = EurorackModularParts:AUDIO-JACK_SMALLSYMBOL: Switching Mono 3.5mm Audio Jack from Erthenvar.; DESC: VCA1 In
U$13 = EurorackModularParts:AUDIO-JACK_SMALLSYMBOL: Switching Mono 3.5mm Audio Jack from Erthenvar.; DESC: 1: B
U$14 = EurorackModularParts:AUDIO-JACK_SMALLSYMBOL: Switching Mono 3.5mm Audio Jack from Erthenvar.; DESC: VCA1 CV
U$15 = EurorackModularParts:AUDIO-JACK_SMALLSYMBOL: Switching Mono 3.5mm Audio Jack from Erthenvar.; DESC: VCA2 In
U$16 = EurorackModularParts:AUDIO-JACK_SMALLSYMBOL: Switching Mono 3.5mm Audio Jack from Erthenvar.; DESC: VCA2 CV
U$17 = EurorackModularParts:AUDIO-JACK_SMALLSYMBOL: Switching Mono 3.5mm Audio Jack from Erthenvar.; DESC: 1: Inverted
U$18 = EurorackModularParts:AUDIO-JACK_SMALLSYMBOL: Switching Mono 3.5mm Audio Jack from Erthenvar.; DESC: VCA1 Out
U$19 = EurorackModularParts:AUDIO-JACK_SMALLSYMBOL: Switching Mono 3.5mm Audio Jack from Erthenvar.; DESC: VCA2 Out
U$20 = EurorackModularParts:AUDIO-JACK_SMALLSYMBOL: Switching Mono 3.5mm Audio Jack from Erthenvar.; DESC: 2: Out 1
U$25 = EurorackModularParts:AUDIO-JACK_SMALLSYMBOL: Switching Mono 3.5mm Audio Jack from Erthenvar.; DESC: 2: B
U$26 = EurorackModularParts:AUDIO-JACK_SMALLSYMBOL: Switching Mono 3.5mm Audio Jack from Erthenvar.; DESC: 2: Out 2
U$27 = EurorackModularParts:AUDIO-JACK_SMALLSYMBOL: Switching Mono 3.5mm Audio Jack from Erthenvar.; DESC: 2: Out 3
U$28 = EurorackModularParts:AUDIO-JACK_SMALLSYMBOL: Switching Mono 3.5mm Audio Jack from Erthenvar.; DESC: 2: C
U$29 = EurorackModularParts:POT; DESC: 2: Offset
U$30 = EurorackModularParts:AUDIO-JACK_SMALLSYMBOL: Switching Mono 3.5mm Audio Jack from Erthenvar.; DESC: 2: Inverted
U$31 = EurorackModularParts:POT; DESC: 2: C Amp
U$32 = EurorackModularParts:V2164

## Net classes
0 default: width 0.203 mm
1 heavypower: width 0.381 mm

## Board
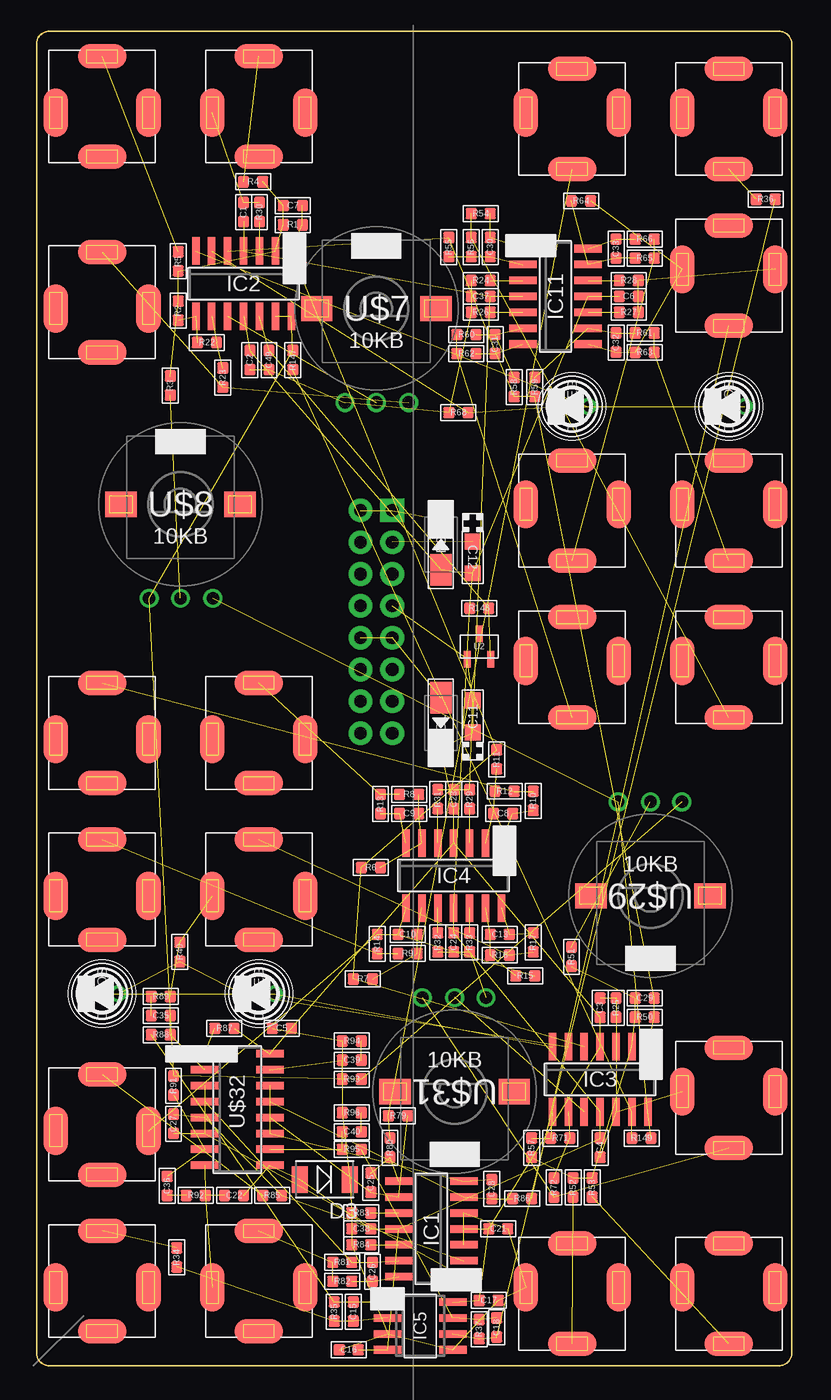
[diagram p3: board, top side]
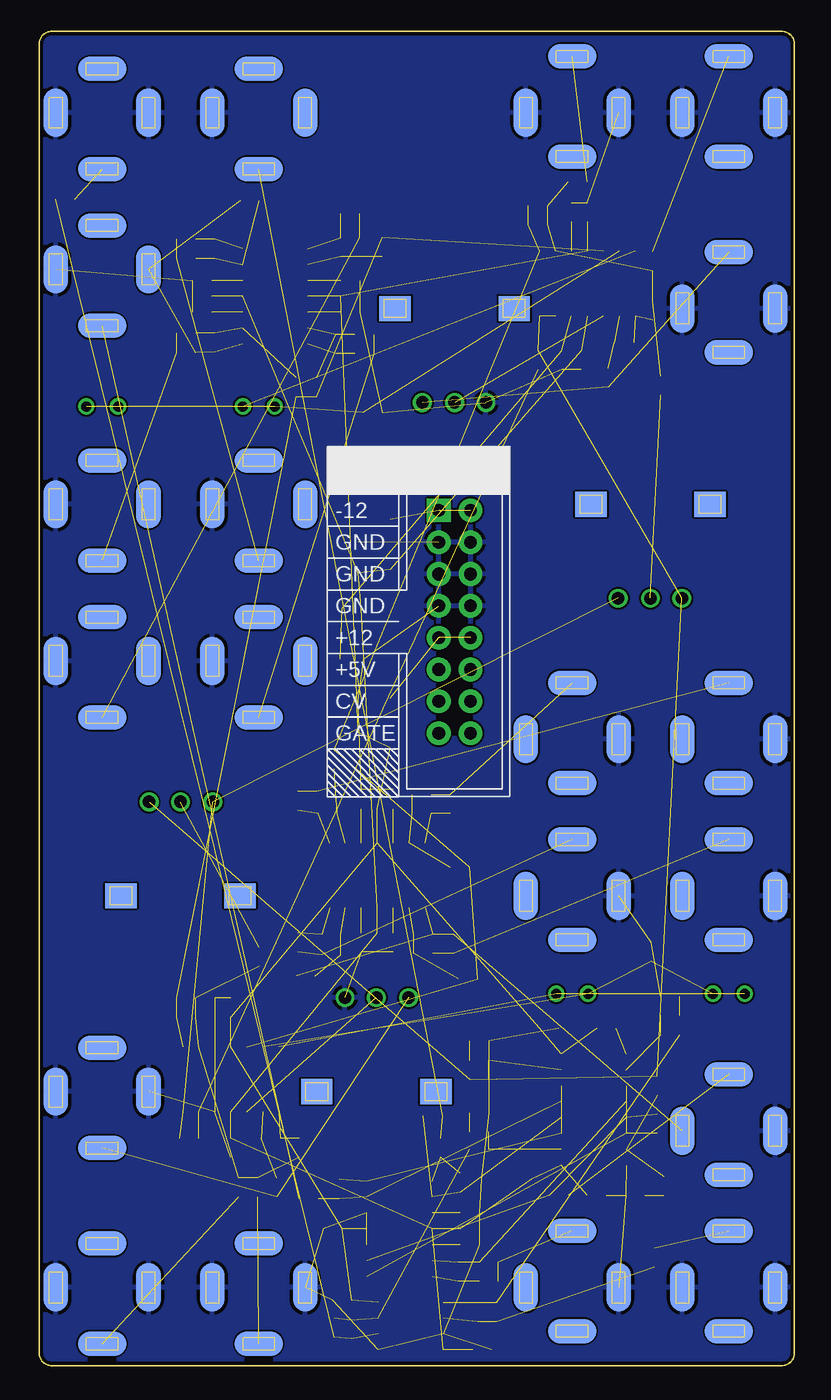
[diagram p4: board, bottom side, seen from below]

Size 60.25 x 106.5 mm. Coordinates in mm from the lower left corner, seen from the top.
Copper layers (1*16): Top 0.035mm / dielectric 1.5mm / Bottom 0.035mm
Design rules "ITEADstudio_DRC": minimum track width 6mil, minimum drill 12mil, track to track 6mil, track to pad 6mil, pad to pad 6mil, via to via 6mil, smd to smd 0mil, copper to edge 10mil, drill to drill 10mil, minimum pad ring 10mil, minimum via ring 6mil, stop-mask expansion 2mil, vias tented up to drill 100mil, thermal gap 10mil

### Footprints (pad centres in the part's own frame; a part is rotated, then mirrored left to right if it is on the bottom)
C0603 = smd 0.889 x 0.889: 1 -0.762,0; 2 0.762,0
CASE-A_3216 = smd 1.27 x 1.27: + -1.27,0; - 1.27,0
DO-214AC = smd 2.5 x 1.7: 1 -2,0; 2 2,0
DO-214AC' = smd 1.27 x 2.1: 1 -1.98,0; 2 1.98,0
3MMLED = drill 0.8: + -1.27,0; - 1.27,0
SO14 = smd 0.6 x 2.2: 1 -3.81,-2.6; 2 -2.54,-2.6; 3 -1.27,-2.6; 4 0,-2.6; 5 1.27,-2.6; 6 2.54,-2.6; 7 3.81,-2.6; 8 3.81,2.6; 9 2.54,2.6; 10 1.27,2.6; 11 0,2.6; 12 -1.27,2.6; 13 -2.54,2.6; 14 -3.81,2.6
SO08 = smd 0.6 x 2.2: 1 -1.905,-2.6; 2 -0.635,-2.6; 3 0.635,-2.6; 4 1.905,-2.6; 5 1.905,2.6; 6 0.635,2.6; 7 -0.635,2.6; 8 -1.905,2.6
POWER_16_SHROUDED = drill 1.016 pad 1.88 square: 1 -8.89,-1.27 | drill 1.016 pad 1.88: 2 -8.89,1.27; 3 -6.35,-1.27; 4 -6.35,1.27; 5 -3.81,-1.27; 6 -3.81,1.27; 7 -1.27,-1.27; 8 -1.27,1.27; 9 1.27,-1.27; 10 1.27,1.27; 11 3.81,-1.27; 12 3.81,1.27; 13 6.35,-1.27; 14 6.35,1.27; 15 8.89,-1.27; 16 8.89,1.27
R0603 = smd 0.889 x 0.889: 1 -0.762,0; 2 0.762,0
SOT95P237X112-3N = smd 1.321 x 0.559: 1 -1.016,0.94; 2 -1.016,-0.94; 3 1.016,0
3.5MM-JACK-SWITCH-13MM-NOHOLES = smd 1.95 x 3.85 bottom: RING_B@1 -3.7,0; SWITCH_B@1 3.7,0 | smd 1.95 x 3.85: RING_T@3 -3.7,0; SWITCH_T@3 3.7,0 | smd 3.85 x 1.95 bottom: SECOND_B@1 0,-3.5; TIP_B@1 0,4.5 | smd 3.85 x 1.95: SECOND_T@3 0,-3.5; TIP_T@3 0,4.5
ALPS_POT_SQUAREHOLES = drill 1: P$1 -2.5,-7.5; P$2 0,-7.5; P$3 2.58,-7.5 | smd 2.5 x 2: P$4 -4.75,0; P$5 4.75,0 | smd 2.5 x 2 bottom: P$6 -4.75,0; P$7 4.75,0
SO16 = smd 0.6 x 2.2: 1 -4.445,-2.6; 2 -3.175,-2.6; 3 -1.905,-2.6; 4 -0.635,-2.6; 5 0.635,-2.6; 6 1.905,-2.6; 7 3.175,-2.6; 8 4.445,-2.6; 9 4.445,2.6; 10 3.175,2.6; 11 1.905,2.6; 12 0.635,2.6; 13 -0.635,2.6; 14 -1.905,2.6; 15 -3.175,2.6; 16 -4.445,2.6

### Placement (x,y rotation side)
C1  16.51,92.08 270 top
C2  17.02,80.26 270 top
C3  44.96,28.57 270 top
C4  44.96,17.4 270 top
C5  19.56,26.92 0 top
C6  47.25,85.34 0 top
C7  20.45,92.58 0 top
C8  37.22,44.07 0 top
C9  29.72,44.07 180 top
C10  29.59,34.42 180 top
C11  34.8,51.82 90 top
C12  34.8,64.52 270 top
C13  36.96,34.42 0 top
C15  25.28,4.32 90 top
C16  24.9,1.27 0 top
C17  36.07,5.21 0 top
C18  36.71,3.05 90 top
C21  36.83,10.92 180 top
C22  15.75,13.59 180 top
C23  33.28,45.21 270 top
C24  33.28,33.78 270 top
C25  26.67,14.61 90 top
C26  26.8,7.49 270 top
C27  10.93,19.3 270 top
C28  36.33,14.1 90 top
C29  48.52,29.34 0 top
C30  36.2,89.28 90 top
C31  36.58,81.53 270 top
C32  46.23,81.66 270 top
C33  46.23,89.15 90 top
C35  9.91,27.94 0 top
C36  10.42,14.35 90 top
C37  35.44,85.34 0 top
C38  25.91,10.92 180 top
C39  25.15,24.38 180 top
C40  25.15,18.67 180 top
C49  18.55,80.26 90 top
D1  32.26,51.31 270 top
D2  32.26,65.53 90 top
D3  SS34  [DO-214AC']  22.99,14.86 180 top
D_1NEG  17.73,29.69 180 top
D_1POS  5.23,29.69 180 top
D_2NEG  42.73,76.56 180 top
D_2POS  55.23,76.56 180 top
IC1  31.5,10.92 90 top
IC2  16.51,86.36 180 top
IC3  44.96,22.86 180 top
IC4  33.28,39.12 180 top
IC5  30.61,3.17 270 top
IC11  41.41,85.34 270 top
J1  27.11,59.38 270 bottom
R1  20.45,91.06 0 top
R2  11.31,84.2 90 top
R3  10.67,78.23 90 top
R4  17.28,94.49 0 top
R5  11.31,88.14 270 top
R6  26.67,39.75 0 top
R7  26.04,30.86 0 top
R8  29.72,45.59 180 top
R9  29.59,32.89 180 top
R10  39.63,45.09 90 top
R11  36.71,48.39 270 top
R12  37.34,45.85 0 top
R13  27.44,44.83 90 top
R14  27.18,33.66 270 top
R15  38.99,31.11 0 top
R16  36.96,32.77 180 top
R17  39.63,33.78 270 top
R22  13.59,81.66 180 top
R23  14.86,78.87 90 top
R24  35.44,86.61 180 top
R25  46.23,28.57 90 top
R26  35.44,84.07 0 top
R27  47.25,84.07 180 top
R28  47.25,86.61 180 top
R29  34.55,45.21 90 top
R30  17.78,92.08 90 top
R31  32.01,45.21 270 top
R32  32.01,33.78 90 top
R33  34.55,33.78 90 top
R34  11.18,8.64 270 top
R35  23.75,4.32 90 top
R36  58.17,93.09 0 top
R37  35.31,2.92 90 top
R40  11.43,33.02 90 top
R50  48.52,27.81 0 top
R51  42.68,32.64 270 top
R52  42.8,14.22 90 top
R53  44.33,14.22 90 top
R54  35.44,91.95 180 top
R55  32.9,89.28 270 top
R56  34.67,89.28 90 top
R57  39.5,17.4 270 top
R58  38.1,78.11 90 top
R59  39.76,78.11 90 top
R60  34.29,82.3 180 top
R61  48.52,82.42 0 top
R62  34.29,80.77 180 top
R63  48.52,80.87 0 top
R64  43.44,92.96 0 top
R65  48.52,88.39 180 top
R66  48.52,89.92 0 top
R68  33.66,76.07 180 top
R71  41.79,18.16 180 top
R72  41.28,14.22 90 top
R79  28.83,19.94 0 top
R80  28.2,17.4 270 top
R81  24.39,8.26 0 top
R82  24.39,6.73 0 top
R83  25.91,12.19 180 top
R84  25.91,9.65 180 top
R85  18.8,13.59 0 top
R86  38.74,13.34 180 top
R87  14.99,26.92 0 top
R88  9.91,26.42 0 top
R89  9.91,29.46 180 top
R91  10.93,22.35 90 top
R92  12.7,13.59 180 top
R93  25.15,22.86 0 top
R94  25.15,25.91 0 top
R95  25.15,17.27 180 top
R96  25.15,20.19 0 top
R147  20.45,80.26 270 top
R148  35.31,60.45 0 top
R149  48.26,18.16 0 top
U2  35.31,57.4 90 top
U$1  -0.25,0 0 top
U$2  5.23,100 0 top
U$3  17.73,50 0 top
U$4  5.23,50 0 top
U$5  5.23,37.5 0 top
U$6  5.23,84.38 0 top
U$7  27.11,84.38 0 top
U$8  11.48,68.75 0 top
U$9  55.23,6.25 180 top
U$12  5.23,6.25 0 top
U$13  17.73,100 0 top
U$14  5.23,18.75 0 top
U$15  55.23,100 180 top
U$16  55.23,87.5 180 top
U$17  17.73,37.5 0 top
U$18  17.73,6.25 0 top
U$19  42.73,100 180 top
U$20  55.23,56.25 180 top
U$25  42.73,6.25 180 top
U$26  42.73,56.25 180 top
U$27  55.23,68.75 180 top
U$28  55.23,21.88 180 top
U$29  48.98,37.5 180 top
U$30  42.73,68.75 180 top
U$31  33.36,21.88 180 top
U$32  16.01,20.45 270 top

### Tracks (layer width: path | path; a pad name or v marks a point on that pad's centre or on a via)
5V  (3 unrouted)
12V  (16 unrouted)
-5V  (6 unrouted)
-5V_TO_5V  (2 unrouted)
-5VIN  (3 unrouted)
-12V  (17 unrouted)
GND  (43 unrouted)
  pour Bottom: 65.29,112.15 -11.08,108.71 -10.44,-4.32 69.38,-8.57
N$1  (1 unrouted)
N$2  (2 unrouted)
N$3  (2 unrouted)
N$4  (2 unrouted)
N$5  (3 unrouted)
N$6  (1 unrouted)
N$7  (6 unrouted)
N$8  (3 unrouted)
N$9  (3 unrouted)
N$10  (2 unrouted)
N$11  (2 unrouted)
N$12  (1 unrouted)
N$13  (2 unrouted)
N$14  (6 unrouted)
N$15  (2 unrouted)
N$16  (2 unrouted)
N$17  (3 unrouted)
N$18  (2 unrouted)
N$19  (2 unrouted)
N$20  (1 unrouted)
N$22  (2 unrouted)
N$26  (1 unrouted)
N$27  (1 unrouted)
N$28  (2 unrouted)
N$29  (1 unrouted)
N$30  (1 unrouted)
N$31  (2 unrouted)
N$32  (1 unrouted)
N$33  (1 unrouted)
N$34  (1 unrouted)
N$35  (1 unrouted)
N$36  (1 unrouted)
N$37  (1 unrouted)
N$38  (3 unrouted)
N$39  (3 unrouted)
N$40  (3 unrouted)
N$41  (3 unrouted)
N$44  (3 unrouted)
N$45  (2 unrouted)
N$53  (2 unrouted)
N$54  (1 unrouted)
N$61  (2 unrouted)
N$63  (1 unrouted)
N$64  (2 unrouted)
N$65  (6 unrouted)
N$66  (2 unrouted)
N$67  (6 unrouted)
N$68  (3 unrouted)
N$69  (1 unrouted)
N$70  (2 unrouted)
N$71  (3 unrouted)
N$72  (3 unrouted)
N$73  (2 unrouted)
N$74  (3 unrouted)
N$76  (2 unrouted)
N$77  (3 unrouted)
N$78  (2 unrouted)
N$80  (3 unrouted)
N$81  (2 unrouted)
N$84  (1 unrouted)
N$85  (2 unrouted)
N$86  (2 unrouted)
N$87  (2 unrouted)
N$88  (3 unrouted)
N$89  (3 unrouted)
N$90  (3 unrouted)
N$91  (3 unrouted)
N$92  (1 unrouted)
N$93  (1 unrouted)
N$94  (2 unrouted)
N$95  (2 unrouted)
N$96  (1 unrouted)
N$97  (2 unrouted)
N$98  (1 unrouted)
N$99  (1 unrouted)
N$100  (2 unrouted)
OUTPUT1_SUM_TO_VCA1  (4 unrouted)
OUTPUT2_SUM_TO_VCA2  (4 unrouted)
VCA1_CV  (1 unrouted)
VCA1_FB  (3 unrouted)
VCA1_IN  (1 unrouted)
VCA1_OUT  (2 unrouted)
VCA1_SUMIN  (1 unrouted)
VCA2_CV  (1 unrouted)
VCA2_IN  (1 unrouted)
VCA2_OUT  (2 unrouted)
VCA2_SUMIN  (1 unrouted)